# Altium schematic sheet LPS_main.SchDoc
size 594 x 420 mm; SheetNumber: 1; SheetTotal: 1
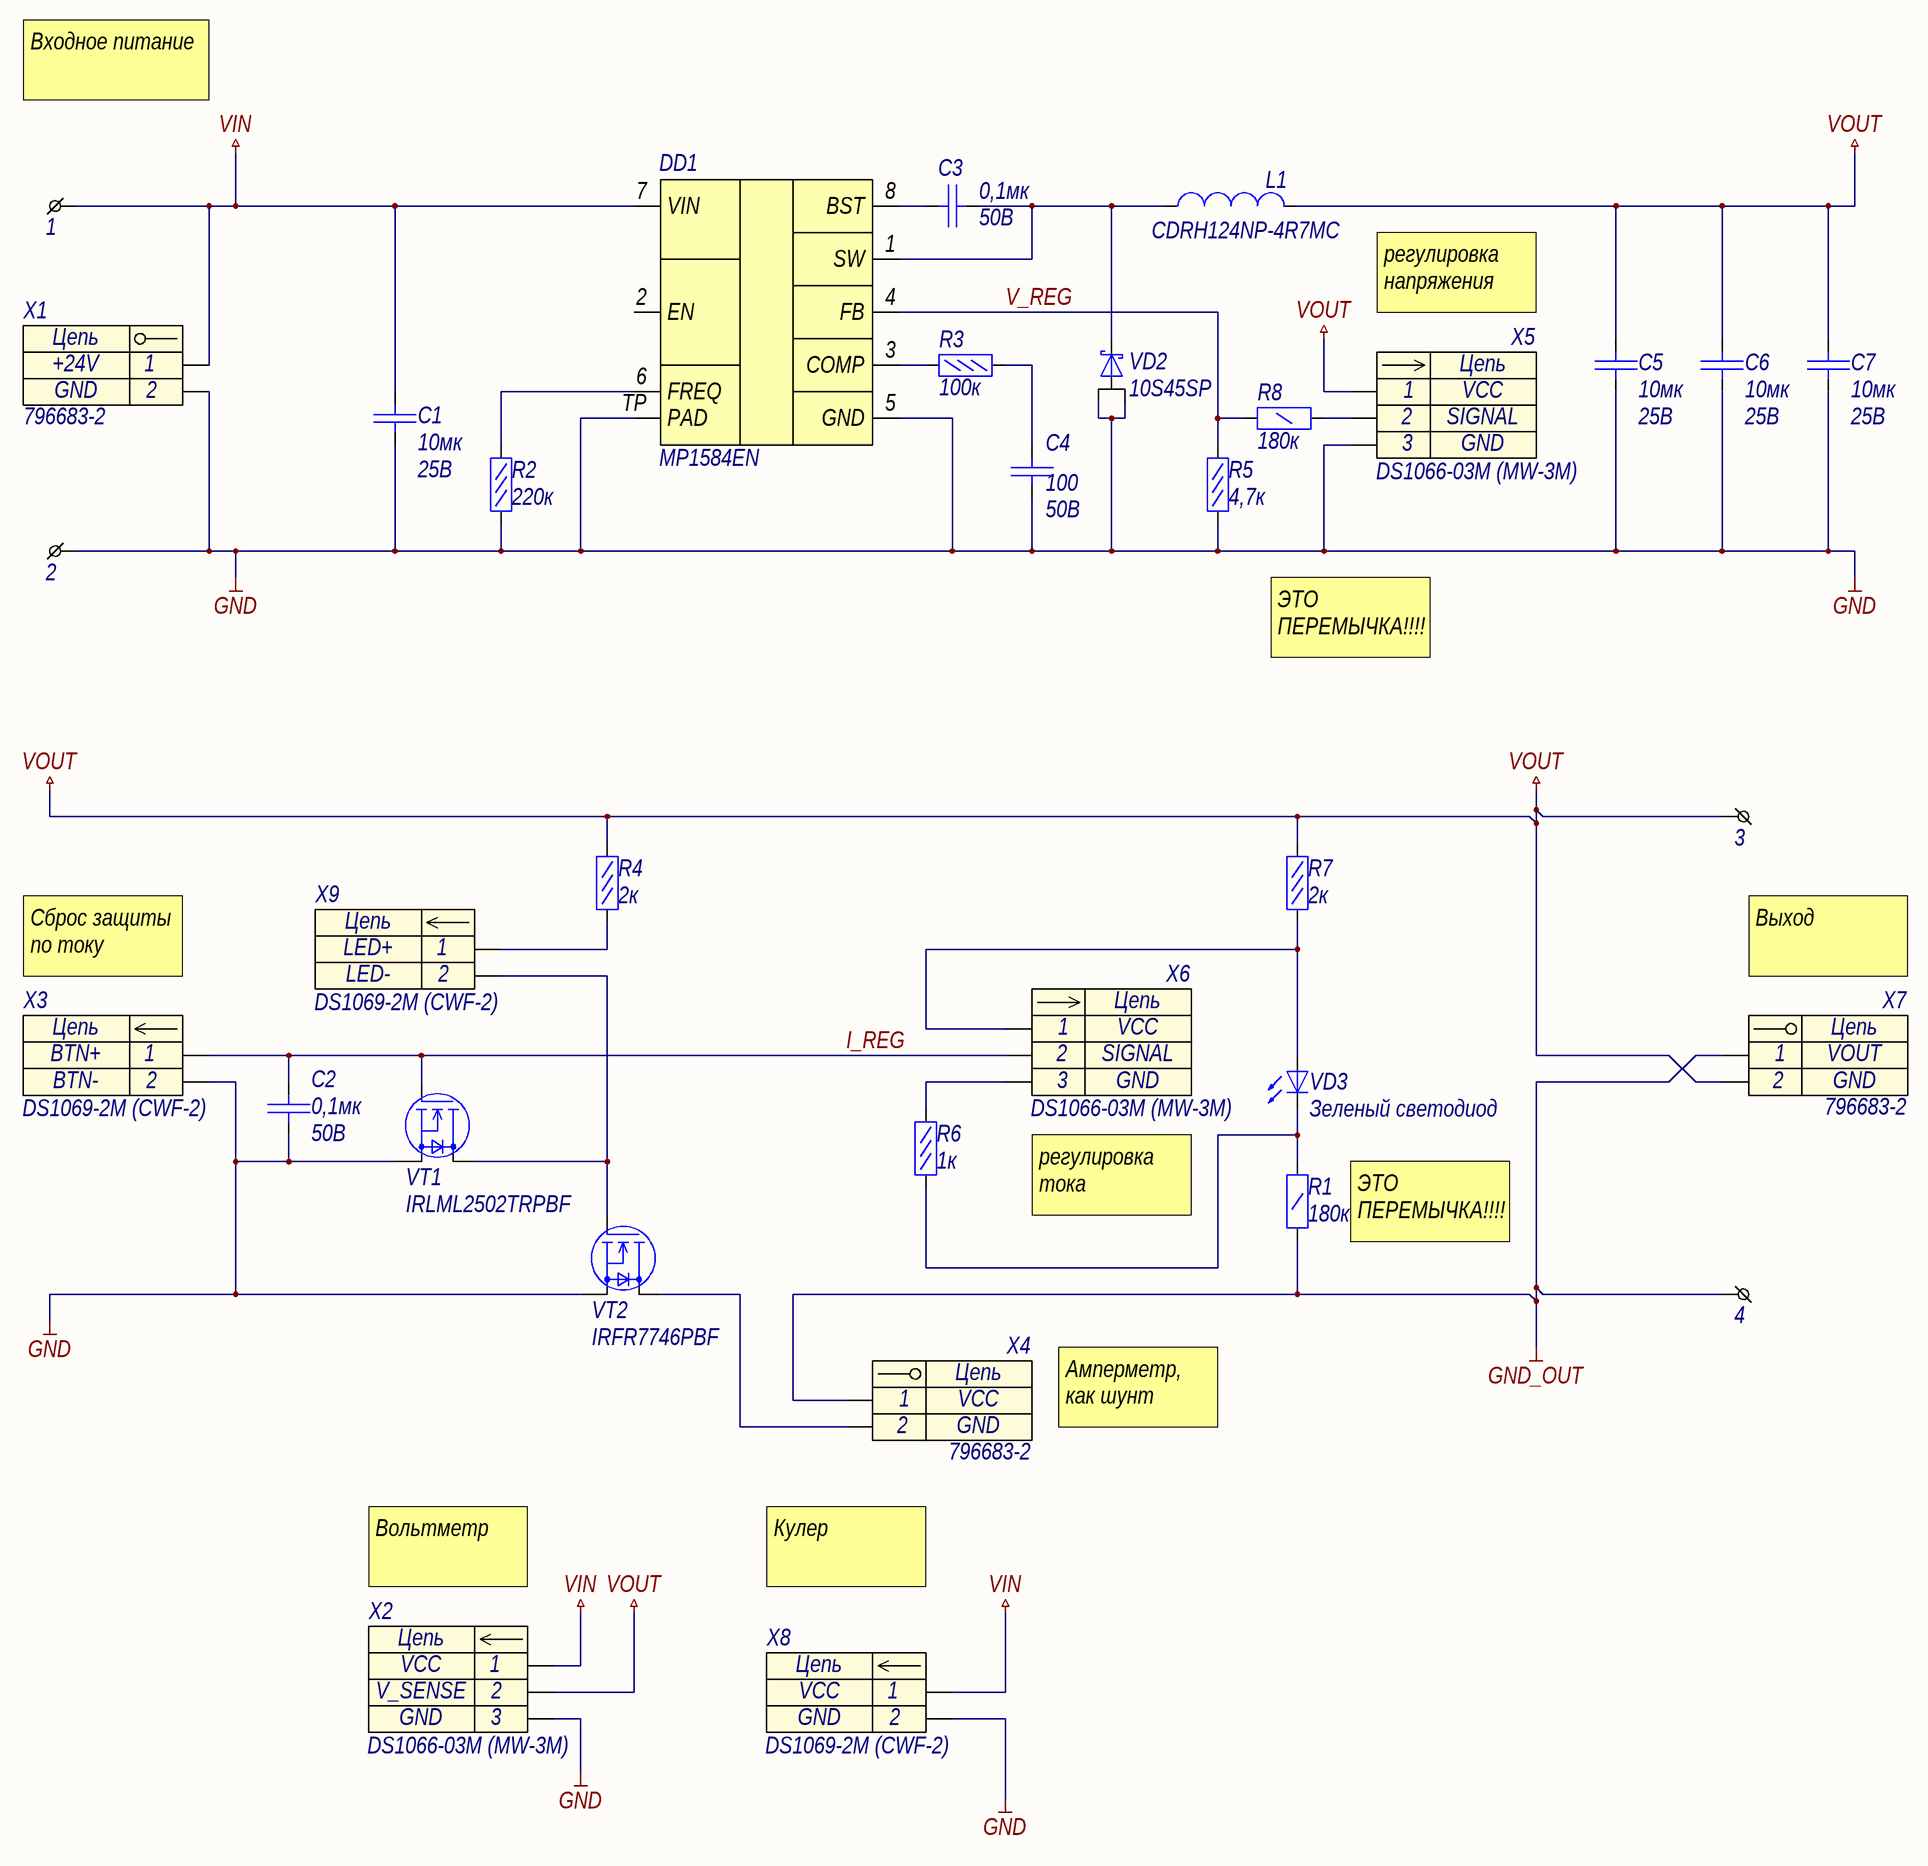
[diagram p0: LPS_main.SchDoc]

## Parts
1  SOLDER_PAD  [PAD_5_8mm]  (value not drawn)  (no BOM)
2  SOLDER_PAD  [PAD_5_8mm]  (value not drawn)  (no BOM)
3  SOLDER_PAD  [PAD_5_8mm]  (value not drawn)  (no BOM)
4  SOLDER_PAD  [PAD_5_8mm]  (value not drawn)  (no BOM)
C1  Voltage: 25В  [C1206]  (hidden comment: 10мк)
C2  Voltage: 50В  [C0603]  (hidden comment: 0,1мк)
C3  Voltage: 50В  [C0603]  (hidden comment: 0,1мк)
C4  Voltage: 50В  [C0603]  (hidden comment: 100)
C5  Voltage: 25В  [C1206]  (hidden comment: 10мк)
C6  Voltage: 25В  [C1206]  (hidden comment: 10мк)
C7  Voltage: 25В  [C1206]  (hidden comment: 10мк)
DD1  MP1584EN  [SOIC-8 with PAD]
L1  CDRH124NP-4R7MC  [CDRH124]
R1  180к  [R1206]
R2  220к  [R0603]
R3  100к  [R0603]
R4  2к  [R0603]
R5  4,7к  [R0603]
R6  1к  [R0603]
R7  2к  [R0603]
R8  180к  [R1206]
VD2  10S45SP  [TO-277A]
VD3  Зеленый светодиод  [VD0603]
VT1  IRLML2502TRPBF  [SOT23-3]
VT2  IRFR7746PBF  [D-PAK]
X1  796683-2  [796683-2]
X2  DS1066-03M (MW-3M)  [MW-3M]
X3  DS1069-2M (CWF-2)  [CWF-2]
X4  796683-2  [796683-2]
X5  DS1066-03M (MW-3M)  [MW-3M]
X6  DS1066-03M (MW-3M)  [MW-3M]
X7  796683-2  [796683-2]
X8  DS1069-2M (CWF-2)  [CWF-2]
X9  DS1069-2M (CWF-2)  [CWF-2]

## Nets
GND: 2.1 C1.1 C2.1 C4.1 C5.1 C6.1 C7.1 DD1.5(GND) DD1.TP(PAD) R2.1 R5.1 VD2.1(A) VD2.2(A) VT1.2(S) VT2.3(S) X1.2 X2.3 X3.2 X5.3 X8.2
GND_OUT: 4.1 R1.1 X4.1 X7.1
VIN: 1.1 C1.2 DD1.7(VIN) X1.1 X2.1 X8.1
VOUT: 3.1 C5.2 C6.2 C7.2 L1.2 R4.2 R7.2 X2.2 X5.1 X7.2
I_REG: C2.2 VT1.1(G) X3.1 X6.2
V_REG: DD1.4(FB) R5.2 R8.2
NetC3_1: C3.1 DD1.8(BST)
NetC3_2: C3.2 DD1.1(SW) L1.1 VD2.3(K)
NetC4_2: C4.2 R3.1
NetDD1_3: DD1.3(COMP) R3.2
NetDD1_6: DD1.6(FREQ) R2.2
NetR1_2: R1.2 R6.1 VD3.2(K)
NetR4_1: R4.1 X9.1
NetR6_2: R6.2 X6.3
NetR7_1: R7.1 VD3.1(A) X6.1
NetR8_1: R8.1 X5.2
NetVT1_3: VT1.3(D) VT2.1(G) X9.2
NetVT2_2: VT2.2(D) X4.2

Not connected (* = marked no-connect by the designer): DD1 2(EN)

## Notes on the sheet
- Входное питание
- регулировка напряжения
- ЭТО ПЕРЕМЫЧКА!!!!
- Сброс защиты по току
- Выход
- (near X6) регулировка тока
- (near R1) ЭТО ПЕРЕМЫЧКА!!!!
- Амперметр, как шунт
- Вольтметр
- Кулер
- Перв. примен.
- Справ. №
- Подп. и дата
- Инв. № дубл.
- Взам. инв. №
- Изм.
- Лист
- № докум.
- Подп.
- Дата
- Лит.
- Масса
- Масштаб
- Т.контр.
- Пров.
- Разраб.
- Листов
- Инв. № подл.
- Н.контр.
- Файл:
- Утв.
- Копировал
- Формат
- (in symbol 796683-2) Цепь
- (in symbol CWF-2) Цепь
- (in symbol MW-3M) Цепь

## Library data of the parts
C1 C5-C7 = CC1206KKX7R8BB106: Конденсатор кер. 10мкФ 25В; Manufacturer: Yageo; TKE: X7R; Name: CC1206KKX7R8BB106; Value: 10мк
C2 C3 = CC0603JPX7R9BB104: Конденсатор кер. 0,1мкФ 50В; Manufacturer: Yageo; TKE: X7R; Name: CC0603JPX7R9BB104; Value: 0,1мк
C4 = CC0603JRNPO9BN101: Конденсатор кер. 100пФ 50В; Manufacturer: Yageo; TKE: NP0; Name: CC0603JRNPO9BN101; Value: 100
DD1 = MP1584EN: регулируемый стабилизатор напряжения; Name: MP1584EN
L1 = CDRH124NP-4R7MC: Катушка с сердечником 4,7мкГн 0,8А; Value: 4,7мк; I saturation: 5,7А; R: 0,014; Name: CDRH124NP-4R7MC
R1 R8 = RC1206FR-07180KL: Резистор 180к 0,25Вт 1%; Manufacturer: YAGEO; Name: RC1206FR-07180KL; Value: 180к
R2 = RC0603FR-07220KL: Резистор 220кОм 0,1Вт 1%; Manufacturer: YAGEO; Name: RC0603FR-07220KL; Tolerance: 1%; Value: 220к
R3 = RC0603FR-07100KL: Резистор 100кОм 0,1Вт 1%; Manufacturer: YAGEO; Name: RC0603FR-07100KL; Tolerance: 1%; Value: 100к
R4 R7 = RC0603FR-072KL: Резистор 2кОм 0,063Вт 1%; Manufacturer: YAGEO; Name: RC0603FR-072KL; Tolerance: 1%; Value: 2к
R5 = RC0603FR-074K7L: Резистор 4,7кОм 0,063Вт 1%; Manufacturer: YAGEO; Name: RC0603FR-074K7L; Tolerance: 1%; Value: 4,7к
R6 = RC0603FR-071KL: Резистор 1кОм 0,063Вт 1%; Manufacturer: YAGEO; Name: RC0603FR-071KL; Tolerance: 1%; Value: 1к
VD2 = 10S45SP: Диод Шоттки 45В 10А; Manufacturer: YFW; Name: 10S45SP
VD3 = FYLS-0603BUGC: Светодтод зеленый SMD Foryard Optoelectronics Co.; Name: Зеленый светодиод
VT1 = IRLML2502TRPBF: N-MOSFET 20В 4,5А; Manufacturer: International Rectifier; Name: IRLML2502TRPBF
VT2 = IRFR7746PBF: N-MOSFET 75В, 56А; Manufacturer: Internationa Rectifier; Name: IRFR7746PBF
X1 = 796683-2: Винтовой клеммник (наборный 2х2); Contact_1: +24V; Contact_2: GND; Name: 796683-2
X2 = MW-3M: Разъем - 3 конт. прямая вилка на плату; Contact_1: VCC; Contact_2: V_SENSE; Contact_3: GND; Name: DS1066-03M (MW-3M)
X3 = CWF-2: Разъем - 2 конт. прямая вилка на плату; Contact_1: BTN+; Contact_2: BTN-; Name: DS1069-2M (CWF-2)
X4 = 796683-2: Винтовой клеммник (наборный 2х2); Contact_1: VCC; Contact_2: GND; Name: 796683-2
X5 X6 = MW-3M: Разъем - 3 конт. прямая вилка на плату; Contact_1: VCC; Contact_2: SIGNAL; Contact_3: GND; Name: DS1066-03M (MW-3M)
X7 = 796683-2: Винтовой клеммник (наборный 2х2); Contact_1: VOUT; Contact_2: GND; Name: 796683-2
X8 = CWF-2: Разъем - 2 конт. прямая вилка на плату; Contact_1: VCC; Contact_2: GND; Name: DS1069-2M (CWF-2)
X9 = CWF-2: Разъем - 2 конт. прямая вилка на плату; Contact_1: LED+; Contact_2: LED-; Name: DS1069-2M (CWF-2)